# EAGLE design smd (EAGLE 8.7.1)
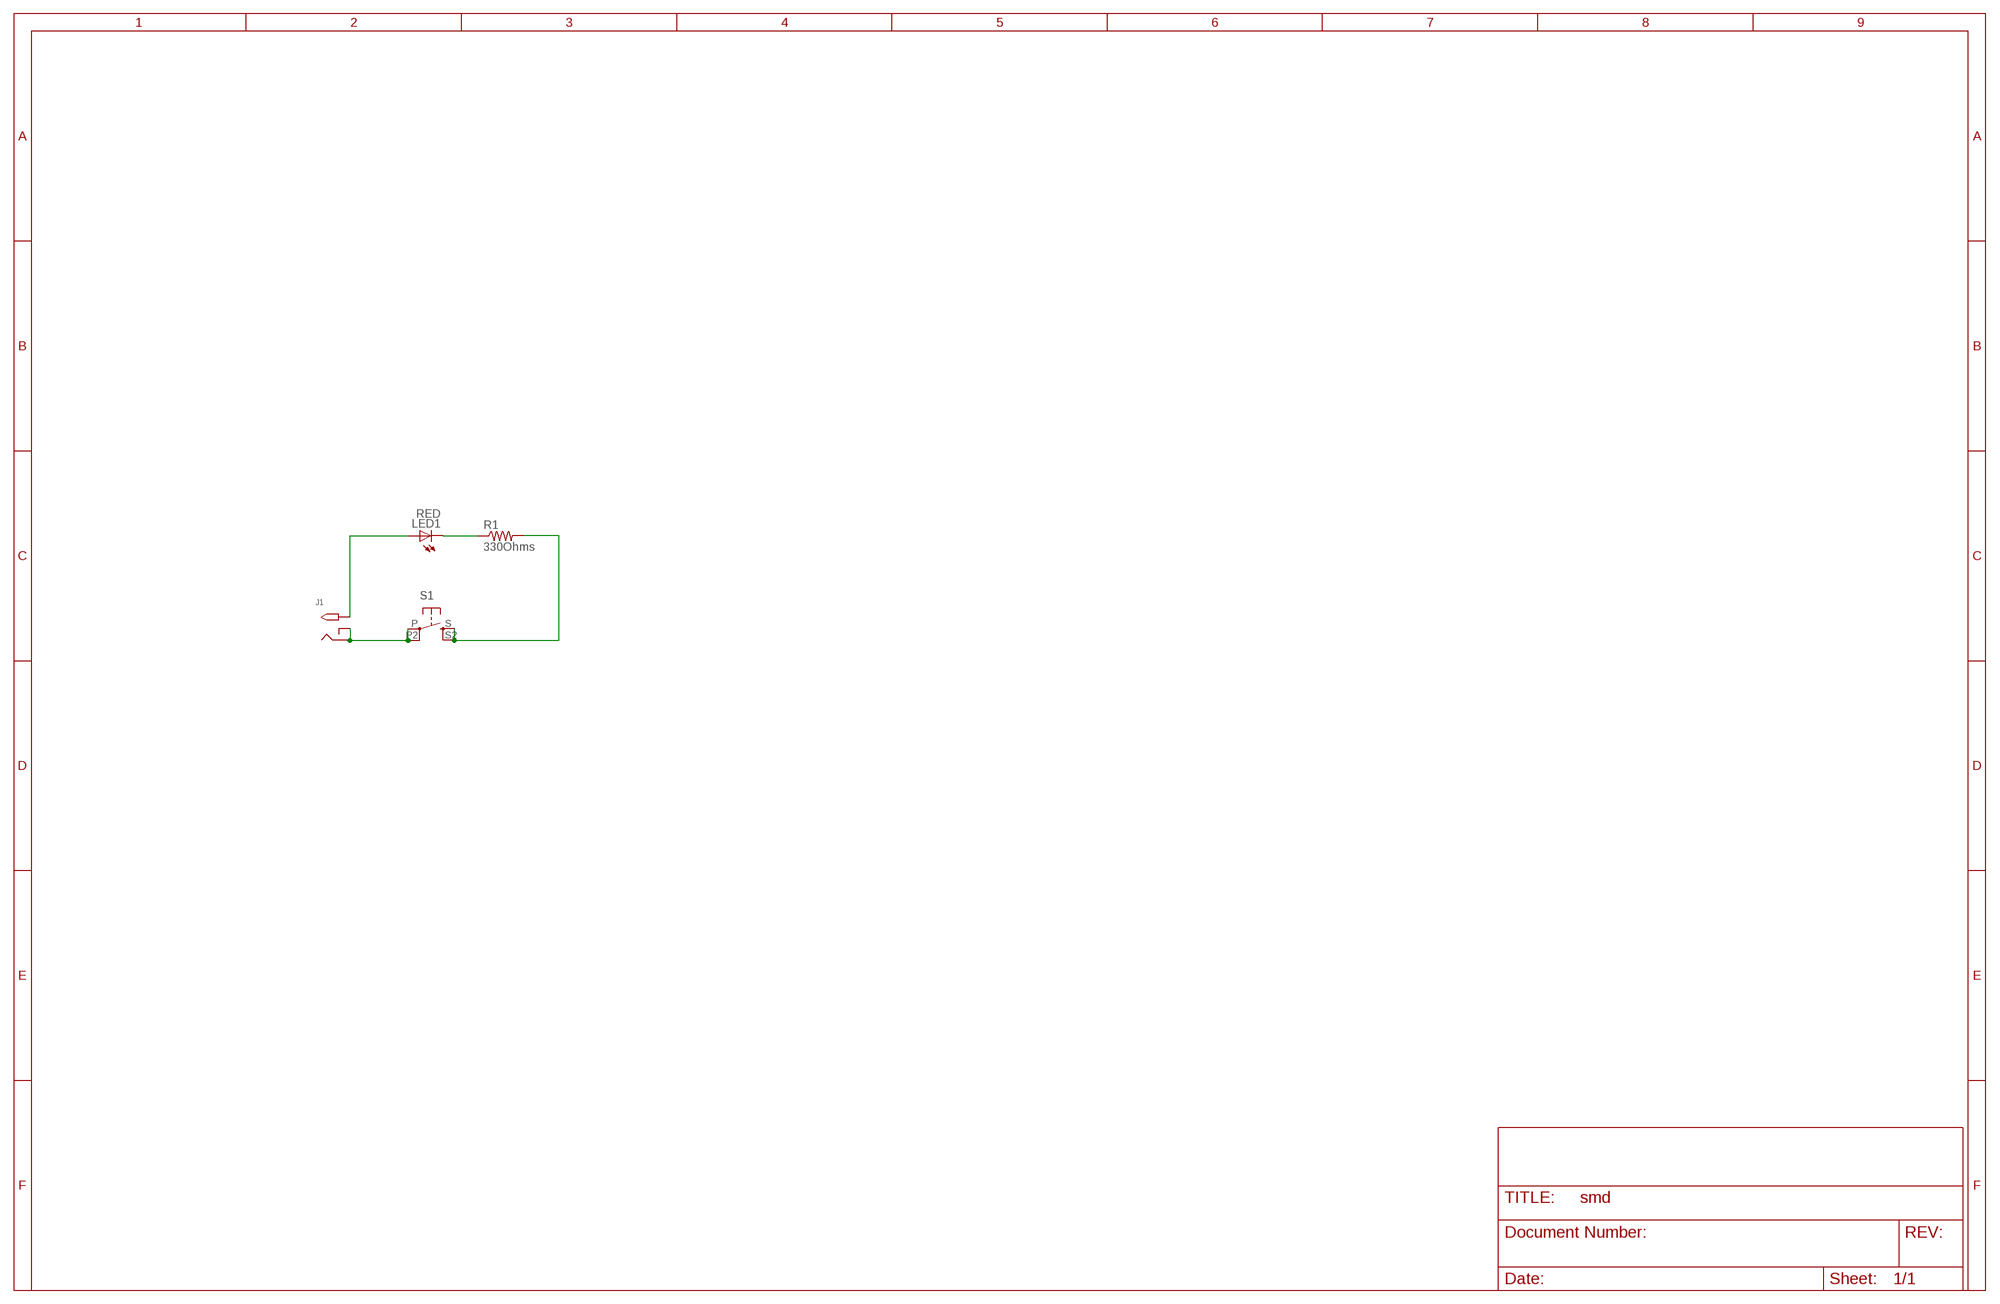
[diagram p0: schematic, sheet 1]
FRAME1 (FRAME_B_L): CREATOR: Unknown; DIST: Unknown; DISTPN: Unknown

## Parts
J1  2.1MMJACKTHM  [PJ-102A]
LED1  RED  LED5MM  [LED5MM]
R1  330Ohms  RESISTORTH-1/4W-CARBON  [RESAD1160W55L680D260_HS]
S1  BUTTON-TACTILE-SMD  [BUTTON-TACTILE-SMD]

## Nets
N$1: J1.TIP LED1.A
N$2: LED1.K(C) R1.1
N$3: R1.2 S1.S S1.S2(S1)
N$4: J1.RING J1.RING_SW S1.P S1.P2(P1)

## Library data of the parts
J1 = Lab01:2.1MMJACK: 2.1mm x 5.5mm THM DC jack with internal switch. Digikey part #PJ-102A, 4UCON part #05537 2.1mm x 5.5mm SMT DC jack with internal switch. Digikey part #PJ-002A-SMT, 4UCON part #03267 By microbuilder.eu & adafruit.com; CREATOR: Swanson; DIST: Digikey; DISTPN: CP-102A-ND; REVIEWER: Swanson
LED1 = Lab01:LED: /; CREATOR: Swanson; DIST: Adafruit; DISTPN: 297; REVIEWER: Swanson
R1 = Lab01:RESISTOR; CREATOR: Swanson; DIST: Digikey; DISTPN: 100QTR-ND; REVIEWER: Swanson
S1 = Lab01_smd:BUTTON-TACTILE; CREATOR: PBROWN; DIST: NA; DISTPN: NA; REVIEWER: Swanson

## Board
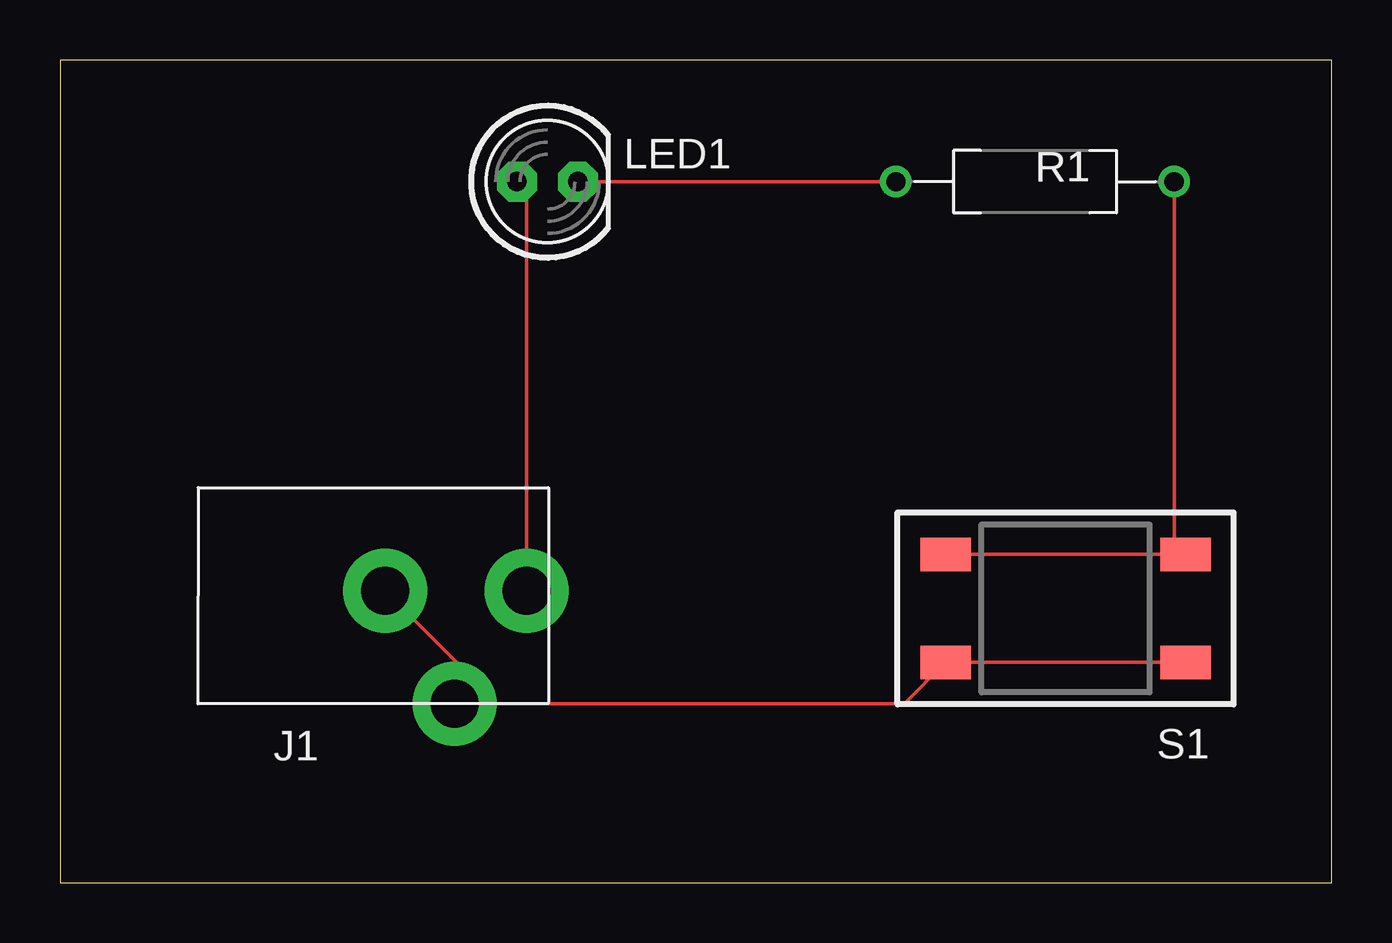
[diagram p1: board, top side]

Size 53.01 x 34.28 mm. Coordinates in mm from the lower left corner, seen from the top.
Outline: 0,0 53.01,0 53.01,34.28 0,34.28 0,0
Copper layers (1*2*15*16): Top 0.035559375mm / dielectric 1.501140625mm / layer 2 0.035559375mm / dielectric 0.149859375mm / layer 15 0.035559375mm / dielectric 0.200659375mm / Bottom 0.035559375mm
Design rules "4pcb-66board": minimum track width 6mil, minimum drill 15mil, track to track 6mil, track to pad 6mil, pad to pad 6mil, via to via 6mil, smd to smd 6mil, copper to edge 15mil, drill to drill 10mil, minimum pad ring 10mil, minimum via ring 15mil, stop-mask expansion 4mil, vias tented up to drill 0mil, thermal gap 10mil

### Footprints (pad centres in the part's own frame; a part is rotated, then mirrored left to right if it is on the bottom)
PJ-102A = drill 2 pad 3.5: RING -6.77,-4.345; RING_SW -3.87,-9.045; TIP -0.87,-4.345
LED5MM = drill 0.813 pad 1.676 octagon: A -1.27,0; K 1.27,0
RESAD1160W55L680D260_HS = drill 0.8 pad 1.2: 1 -5.8,0; 2 5.8,0
BUTTON-TACTILE-SMD = smd 2.1 x 1.4: P -5,2.25; P2 5,2.25; S -5,-2.25; S2 5,-2.25

### Placement (x,y rotation side)
J1  20.32,16.51 0 top
LED1  20.32,29.21 0 top
R1  40.64,29.21 0 top
S1  41.91,11.43 180 top

### Tracks (layer width: path | path; a pad name or v marks a point on that pad's centre or on a via)
N$1
  Top 0.152: J1.TIP 19.45,28.81 LED1.A
N$2
  Top 0.152: LED1.K R1.1
N$3
  Top 0.152: R1.2 46.44,14.15 S1.S S1.S2
N$4
  Top 0.152: S1.P S1.P2 35.2,7.46 16.51,7.46 | 16.51,7.46 J1.RING_SW | J1.RING 16.51,9.21 16.51,7.46